# EAGLE schematic devBoard-v1 (EAGLE 6.1)
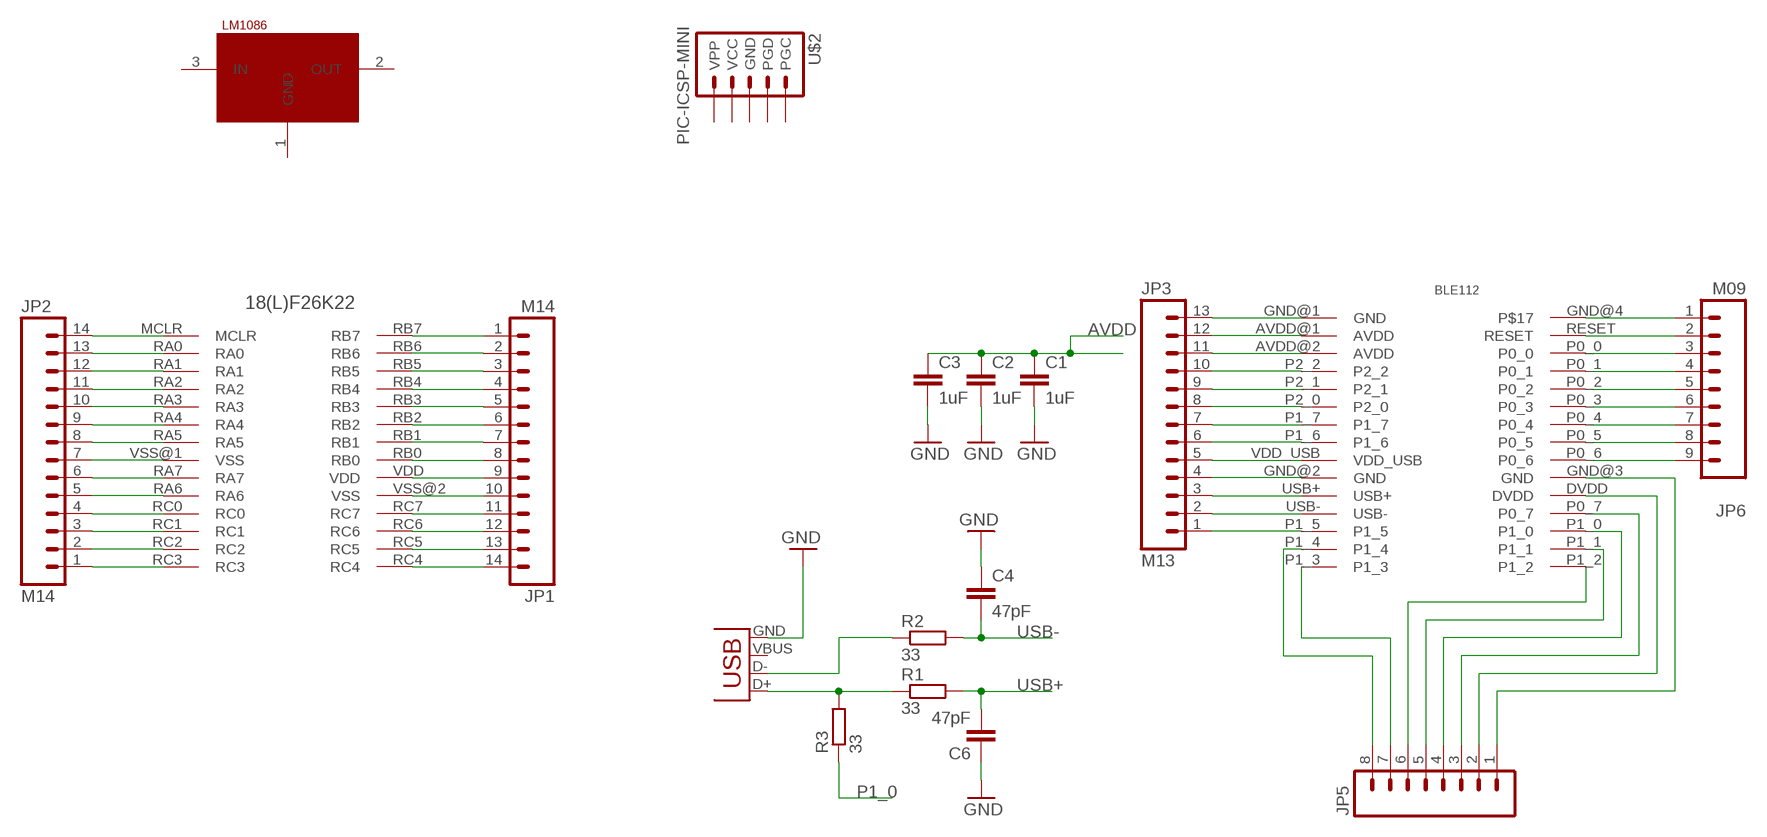
[diagram p0: schematic, sheet 1]

## Parts
C1  1uF  C-EU050-024X044  [C050-024X044]
C2  1uF  C-EU050-024X044  [C050-024X044]
C3  1uF  C-EU050-024X044  [C050-024X044]
C4  47pF  C-EU025-024X044  [C025-024X044]
C6  47pF  C-EU025-024X044  [C025-024X044]
JP1  M14  [1X14]
JP2  M14  [1X14]
JP3  M13  [1X13]
JP4  USB-B  USBPTH  [USB-B-PTH]
JP5  M081X08  [1X08]
JP6  M09  [1X09]
R1  33  R-EU_0207/10  [0207/10]
R2  33  R-EU_0207/10  [0207/10]
R3  33  R-EU_0207/10  [0207/10]
U$1  LM1086  [TO-220-H]
U$2  PIC-ICSP-MINI  [PIC-ICSP-MINI]
U$3  PIC18(L)F26K22  [28-LEAD_SOIC]
U$4  BLE112"  [BLE112]

## Nets
AVDD: C1.1 C2.1 C3.1 JP3.5 JP3.11 JP3.12 JP5.2 U$4.AVDD@1(AVDD) U$4.AVDD@2(AVDD) U$4.DVDD U$4.VDD_USB
GND: C1.2 C2.2 C3.2 C4.1 C6.1 JP4.GND
N$1: JP3.13 U$4.GND@1(GND)
N$2: JP4.D- R2.1
N$3: JP4.D+ R1.1 R3.2
N$4: JP3.10 U$4.P2_2
N$5: JP3.9 U$4.P2_1
N$6: JP3.8 U$4.P2_0
N$7: JP3.7 U$4.P1_7
N$8: JP3.6 U$4.P1_6
N$9: JP2.14 U$3.MCLR
N$10: JP3.4 U$4.GND@2(GND)
N$11: JP2.13 U$3.RA0
N$12: JP2.12 U$3.RA1
N$13: JP3.1 U$4.P1_5
N$14: JP6.1 U$4.GND@4
N$15: JP6.2 U$4.RESET
N$16: JP6.3 U$4.P0_0
N$17: JP6.4 U$4.P0_1
N$18: JP6.5 U$4.P0_2
N$19: JP6.6 U$4.P0_3
N$20: JP6.7 U$4.P0_4
N$21: JP6.8 U$4.P0_5
N$22: JP6.9 U$4.P0_6
N$23: JP5.7 U$4.P1_3
N$24: JP5.8 U$4.P1_4
N$25: JP5.6 U$4.P1_2
N$26: JP5.5 U$4.P1_1
N$27: JP2.11 U$3.RA2
N$28: JP5.3 U$4.P0_7
N$29: JP2.10 U$3.RA3
N$30: JP5.1 U$4.GND@3(GND)
N$31: JP2.9 U$3.RA4
N$32: JP2.8 U$3.RA5
N$33: JP2.7 U$3.VSS@1(VSS)
N$34: JP2.6 U$3.RA7
N$35: JP2.5 U$3.RA6
N$36: JP2.4 U$3.RC0
N$37: JP2.3 U$3.RC1
N$38: JP2.2 U$3.RC2
N$39: JP2.1 U$3.RC3
N$40: JP1.1 U$3.RB7
N$41: JP1.2 U$3.RB6
N$42: JP1.3 U$3.RB5
N$43: JP1.4 U$3.RB4
N$44: JP1.5 U$3.RB3
N$45: JP1.6 U$3.RB2
N$46: JP1.7 U$3.RB1
N$47: JP1.8 U$3.RB0
N$48: JP1.9 U$3.VDD
N$49: JP1.10 U$3.VSS@2(VSS)
N$50: JP1.11 U$3.RC7
N$51: JP1.12 U$3.RC6
N$52: JP1.13 U$3.RC5
N$53: JP1.14 U$3.RC4
P1_0: JP5.4 R3.1 U$4.P1_0
USB+: C6.2 JP3.3 R1.2 U$4.USB+
USB-: C4.2 JP3.2 R2.2 U$4.USB-
Unconnected: JP4.VBUS U$2.1(VPP) U$2.2(VCC) U$2.3(GND) U$2.4(PGD) U$2.5(PGC)

## Power pins joined to a net without a drawn wire
GND: U$1.1(GND)
IN: U$1.3(IN)
OUT: U$1.2(OUT)

## Library data of the parts
C1-C4 C6 = rcl:C-EU: CAPACITOR, European symbol
JP1 JP2 = SparkFun-Connectors:M14: Header 14 Standard 14-pin 0.1" header. Use with straight break away headers (SKU : PRT-00116), right angle break away headers (PRT-00553), swiss pins (PRT-00743), machine pins (PRT-00117), and female headers (PRT-00115).
JP3 = SparkFun-Connectors:M13: 13-pin single row .1" header
JP4 = SparkFun-Connectors:USB: USB Connectors USB-B-PTH is fully proven SKU : PRT-00139/CONN-08278 USB-miniB is fully proven SKU : PRT-00587 USB-A-PCB is untested. USB-A-H is throughly reviewed, but untested. Spark Fun Electronics SKU : PRT-00437 USB-B-SMT is throughly reviewed, but untested. Needs silkscreen touching up. USB-A-S has not been used/tested USB-MB-H has not been used/tested USB-MICROB has been used. CONN-09505; PROD_ID: CONN-08278
JP5 = SparkFun-Connectors:M08: Header 8 Standard 8-pin 0.1" header. Use with straight break away headers (SKU : PRT-00116), right angle break away headers (PRT-00553), swiss pins (PRT-00743), machine pins (PRT-00117), and female headers (PRT-00115).
JP6 = SparkFun-Connectors:M09: Header 9 Standard 9-pin 0.1" header. Use with straight break away headers (SKU : PRT-00116), right angle break away headers (PRT-00553), swiss pins (PRT-00743), machine pins (PRT-00117), and female headers (PRT-00115).
R1-R3 = rcl:R-EU_: RESISTOR, European symbol
U$1 = notiDroid-components:LM1086: The LM1086 is a series of low dropout positive • Available in 1.8V, 2.5V, 2.85V, 3.3V, 3.45V, 5V voltage regulators with a maximum dropout of 1.5V at and Adjustable Versions 1.5A of load current
U$2 = SparkFun-Connectors:PIC-ICSP-MINI: PIC-ICSP-Mini Miniature 5-pin connection for temporary programming of PICs. Use this device in your design to save space. Program the PIC with this adapter Spark Fun Electronics SKU : BOB-00194
U$3 = PIC18:PIC18(L)F26K22
U$4 = BLE112:BLE112: The BLE112 is a Bluetooth Smart module targeted for low-power sensors and accessories. It integrates all features required for a Bluetooth Smart application, including Bluetooth radio, software stack, and GATT-based profiles.